# EAGLE design usb_to_can (EAGLE 9.4.2)
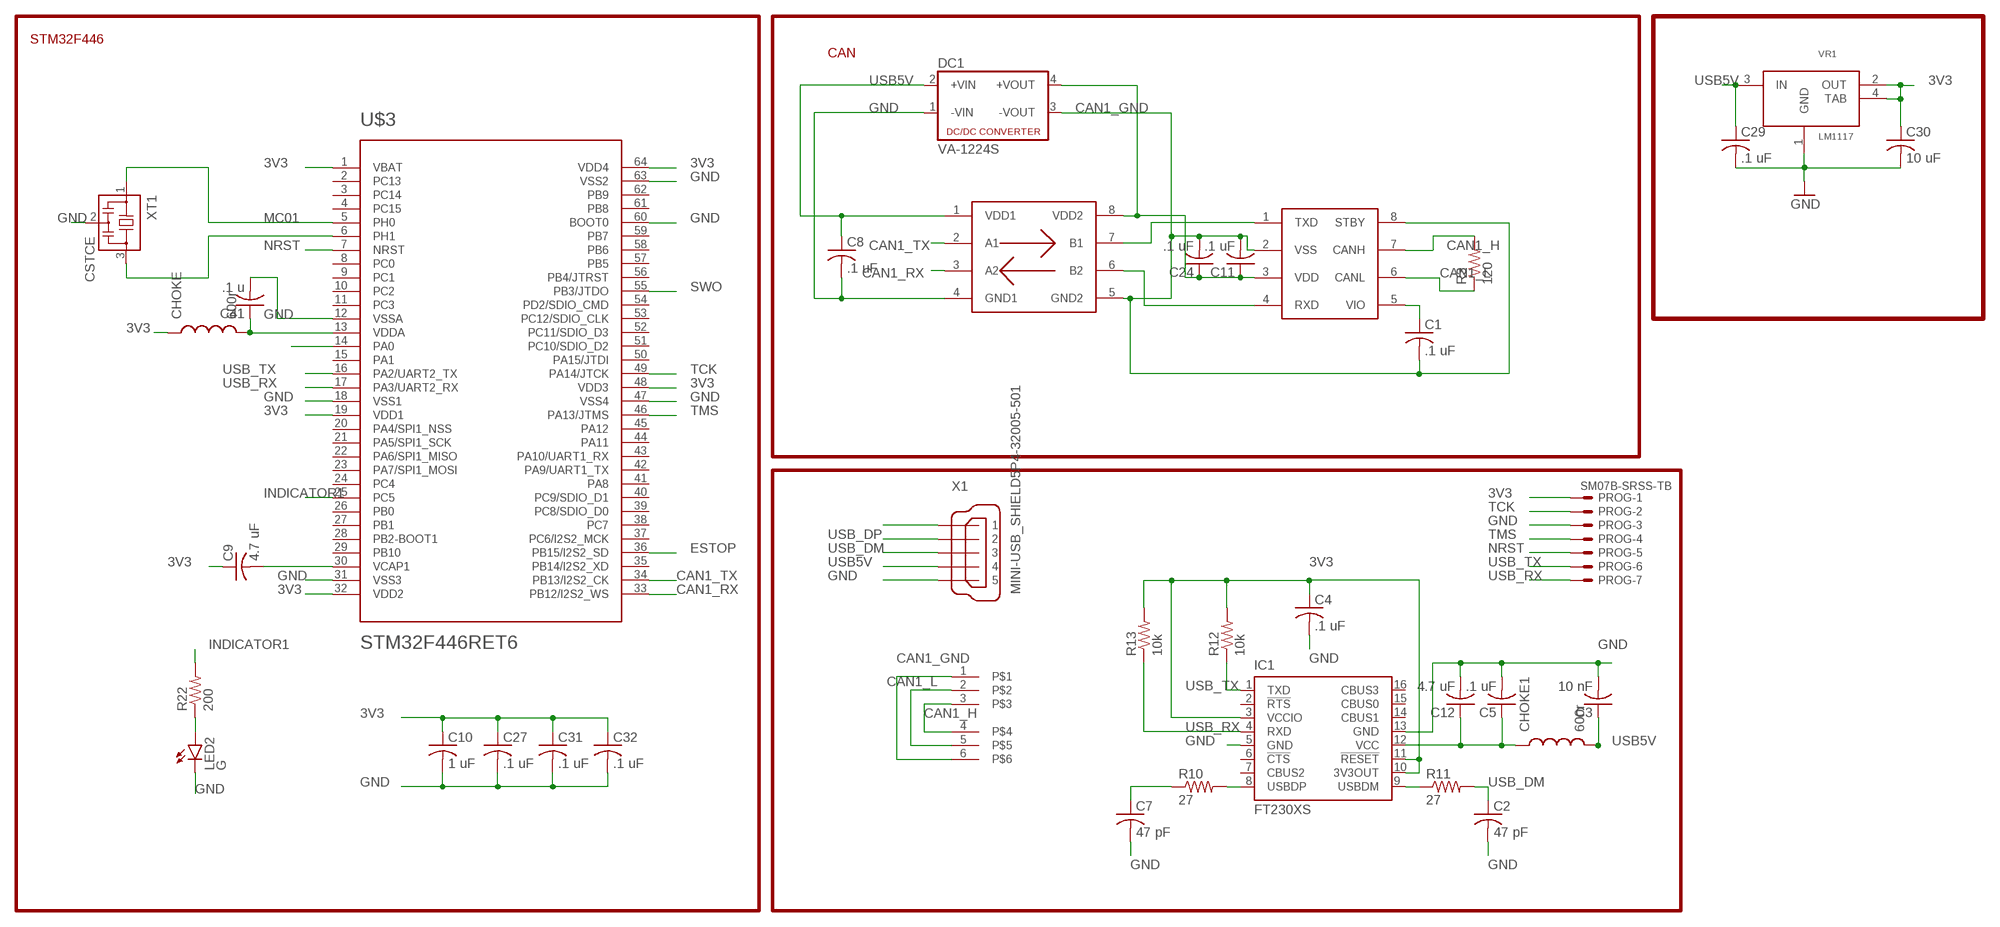
[diagram p0: schematic, sheet 1]

## Parts
C1  .1 uF  C-USC0402K  [C0402K]
C2  47 pF  C-USC0402K  [C0402K]
C3  10 nF  C-USC0402K  [C0402K]
C4  .1 uF  C-USC0402K  [C0402K]
C5  .1 uF  C-USC0402K  [C0402K]
C7  47 pF  C-USC0402K  [C0402K]
C8  .1 uF  C-USC0402K  [C0402K]
C9  4.7 uF  C-USC0402K  [C0402K]
C10  1 uF  C-USC0402K  [C0402K]
C11  .1 uF  C-USC0402K  [C0402K]
C12  4.7 uF  C-USC0402K  [C0402K]
C24  .1 uF  C-USC0402K  [C0402K]
C27  .1 uF  C-USC0402K  [C0402K]
C29  .1 uF  C-USC0402K  [C0402K]
C30  10 uF  C-USC0402K  [C0402K]
C31  .1 uF  C-USC0402K  [C0402K]
C32  .1 uF  C-USC0402K  [C0402K]
C41  .1 u  C-USC0402K  [C0402K]
CHOKE  600r  INDUCTOR0603  [0603]
CHOKE1  600r  INDUCTOR0603  [0603]
DC1  VA-1224S  [4SIL]
IC1  FT230XS  [SSOP16]
LED2  G  LED0603  [LED-0603]
PROG  SM07B-SRSS-TB  [SM07B-SRSS-TB]
R3  120  R-US_R0402  [R0402]
R10  27  R-US_R0402  [R0402]
R11  27  R-US_R0402  [R0402]
R12  10k  R-US_R0402  [R0402]
R13  10k  R-US_R0402  [R0402]
R22  200  R-US_R0402  [R0402]
U$1  6-PIN  [M80-5400642]
U$3  STM32F446RET6  [TQFP64]
U$4  MCP2561  [SO08]
U$8  SI8410  [SO08]
VR1  LM1117  [SOT-223]
X1  MINI-USB_SHIELD5P4-32005-501  [32005-501]
XT1  CSTCE  [CSTCE]

## Nets
3V3: C4.1 C9.1 C10.1 C27.1 C30.1 C31.1 C32.1 CHOKE.1 IC1.3(VCCIO) IC1.10(3V3OUT) IC1.11(!RESET) PROG.1 R12.2 R13.2 U$3.1(VBAT) U$3.19(VDD1) U$3.32(VDD2) U$3.48(VDD3) U$3.64(VDD4) VR1.2(OUT) VR1.4(TAB)
CAN1_GND: C1.2 C11.2 C24.2 DC1.3(-VOUT) U$1.1 U$1.6 U$4.2(VSS) U$4.8(STBY) U$8.5(GND2)
CAN1_H: R3.2 U$1.3 U$1.4 U$4.7(CANH)
CAN1_L: R3.1 U$1.2 U$1.5 U$4.6(CANL)
CAN1_RX: U$3.33(PB12/I2S2_WS) U$8.3(A2)
CAN1_TX: U$3.34(PB13/I2S2_CK) U$8.2(A1)
ESTOP: U$3.36(PB15/I2S2_SD)
GND: C2.2 C3.2 C4.2 C5.2 C7.2 C8.2 C10.2 C12.2 C27.2 C29.2 C30.2 C31.2 C32.2 C41.2 DC1.1(-VIN) IC1.5(GND) IC1.13(GND) LED2.C PROG.3 U$3.12(VSSA) U$3.18(VSS1) U$3.31(VSS3) U$3.47(VSS4) U$3.60(BOOT0) U$3.63(VSS2) U$8.4(GND1) VR1.1(GND) X1.5 XT1.2
INDICATOR1: R22.2 U$3.25(PC5)
MC01: U$3.5(PH0) XT1.1
N$2: C41.1 CHOKE.2 U$3.13(VDDA)
N$3: C9.2 U$3.30(VCAP1)
N$6: C1.1 U$4.5(VIO)
N$9: X1.1
N$10: C5.1 C12.1 CHOKE1.1 IC1.12(VCC)
N$11: IC1.8(USBDP) R10.2
N$12: C11.1 C24.1 DC1.4(+VOUT) U$4.3(VDD) U$8.8(VDD2)
N$14: U$4.1(TXD) U$8.7(B1)
N$15: IC1.9(USBDM) R11.1
N$16: U$4.4(RXD) U$8.6(B2)
N$24: U$3.14(PA0)
N$28: LED2.A R22.1
N$30: U$3.6(PH1) XT1.3
NRST: PROG.5 U$3.7(NRST)
SWO: U$3.55(PB3/JTDO)
TCK: PROG.2 U$3.49(PA14/JTCK)
TMS: PROG.4 U$3.46(PA13/JTMS)
USB5V: C3.1 C8.1 C29.1 CHOKE1.2 DC1.2(+VIN) U$8.1(VDD1) VR1.3(IN) X1.4
USB_DM: C2.1 R11.2 X1.3
USB_DP: C7.1 R10.1 X1.2
USB_RX: IC1.4(RXD) PROG.7 R13.1 U$3.17(PA3/UART2_RX)
USB_TX: IC1.1(TXD) PROG.6 R12.1 U$3.16(PA2/UART2_TX)
Unconnected: IC1.2(!RTS) IC1.6(!CTS) IC1.7(CBUS2) IC1.14(CBUS1) IC1.15(CBUS0) IC1.16(CBUS3) U$3.2(PC13) U$3.3(PC14) U$3.4(PC15) U$3.8(PC0) U$3.9(PC1) U$3.10(PC2) U$3.11(PC3) U$3.15(PA1) U$3.20(PA4/SPI1_NSS) U$3.21(PA5/SPI1_SCK) U$3.22(PA6/SPI1_MISO) U$3.23(PA7/SPI1_MOSI) U$3.24(PC4) U$3.26(PB0) U$3.27(PB1) U$3.28(PB2-BOOT1) U$3.29(PB10) U$3.35(PB14/I2S2_XD) U$3.37(PC6/I2S2_MCK) U$3.38(PC7) U$3.39(PC8/SDIO_D0) U$3.40(PC9/SDIO_D1) U$3.41(PA8) U$3.42(PA9/UART1_TX) U$3.43(PA10/UART1_RX) U$3.44(PA11) U$3.45(PA12) U$3.50(PA15/JTDI) U$3.51(PC10/SDIO_D2) U$3.52(PC11/SDIO_D3) U$3.53(PC12/SDIO_CLK) U$3.54(PD2/SDIO_CMD) U$3.56(PB4/JTRST) U$3.57(PB5) U$3.58(PB6) U$3.59(PB7) U$3.61(PB8) U$3.62(PB9) X1.M1(S1) X1.M2(S2) X1.M3(S3) X1.M4(S4)

## Notes on the sheet
- STM32F446
- CAN

## Library data of the parts
C1-C5 C7-C12 C24 C27 C29-C32 C41 = rcl:C-US: CAPACITOR, American symbol
CHOKE CHOKE1 = SparkFun-Passives:INDUCTOR: Inductors Basic Inductor/Choke - 0603 and 1206. Footprints are not proven and vary greatly between part numbers. INDUCTOR POWER 3.3UH 4.0A SMD 0.197" L x 0.197" W x 0.177" H (5.00mm x 5.00mm x 4.50mm)
DC1 = dc-dc-converter:VA-*?: DC DC Converter Single Output, 1 Watt Motien Technology Co.,Ltd. Source: va-serie.pdf; OC_FARNELL: unknown; OC_NEWARK: unknown
IC1 = ftdichip:FT230X: USB to BASIC UART IC Auto generated by make-symbol-device-package-bsdl.ulp Rev. 43 Source: Data sheet <http://www.ftdichip.com/Support/Documents/DataSheets/ICs/DS_FT230X.pdf>
LED2 = SparkFun-LED:LED: LEDs Standard schematic elements and footprints for 5mm, 3mm, 1206, and 0603 sized LEDs. 5mm - Spark Fun Electronics SKU : COM-00529 (and others)
PROG = con-jst2:?M07B-SRSS-TB: Disconnectable Crimp style connector, 1.0mm pitch 7 contacts
R3 R10-R13 R22 = rcl:R-US_: RESISTOR, American symbol
U$1 = Ben_Library:6-PIN
U$3 = BenLibrary:STM32F446RET6: ARM DSP Chip used on the WAV Trigger board.
U$4 = BenLibrary:MCP2561
U$8 = BenLibrary:SI8410
VR1 = sc_usercreated:LM1117
X1 = con-cypressindustries:MINI-USB_SHIELD5P4-: MINI USB-B R/A W/O POST 5 pol. Source: www.cypressindustries.com; OC_FARNELL: unknown; OC_NEWARK: unknown
XT1 = sc_usercreated:CSTCE

## Board
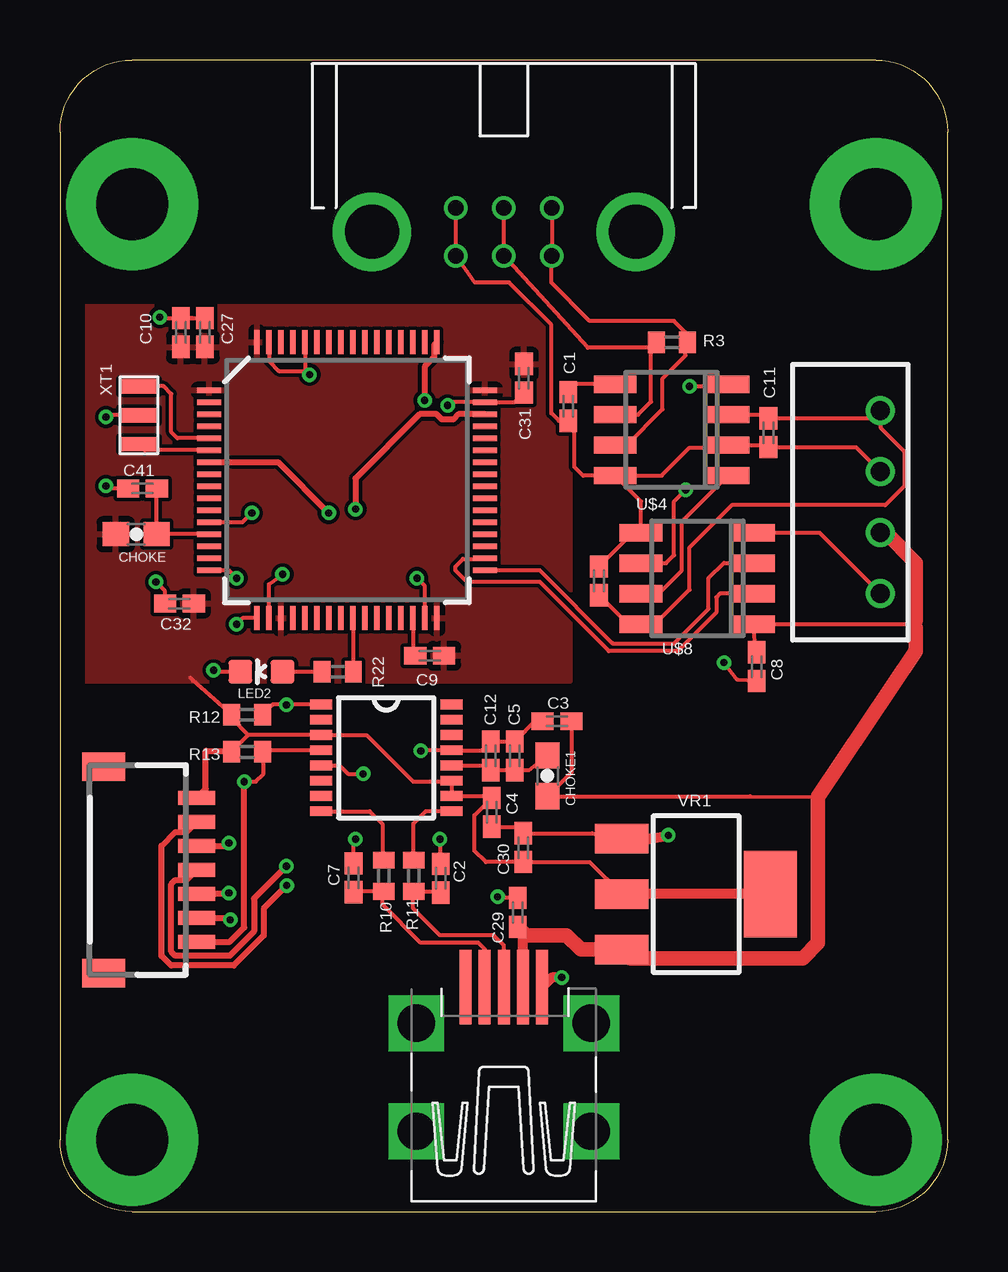
[diagram p1: board, top side]
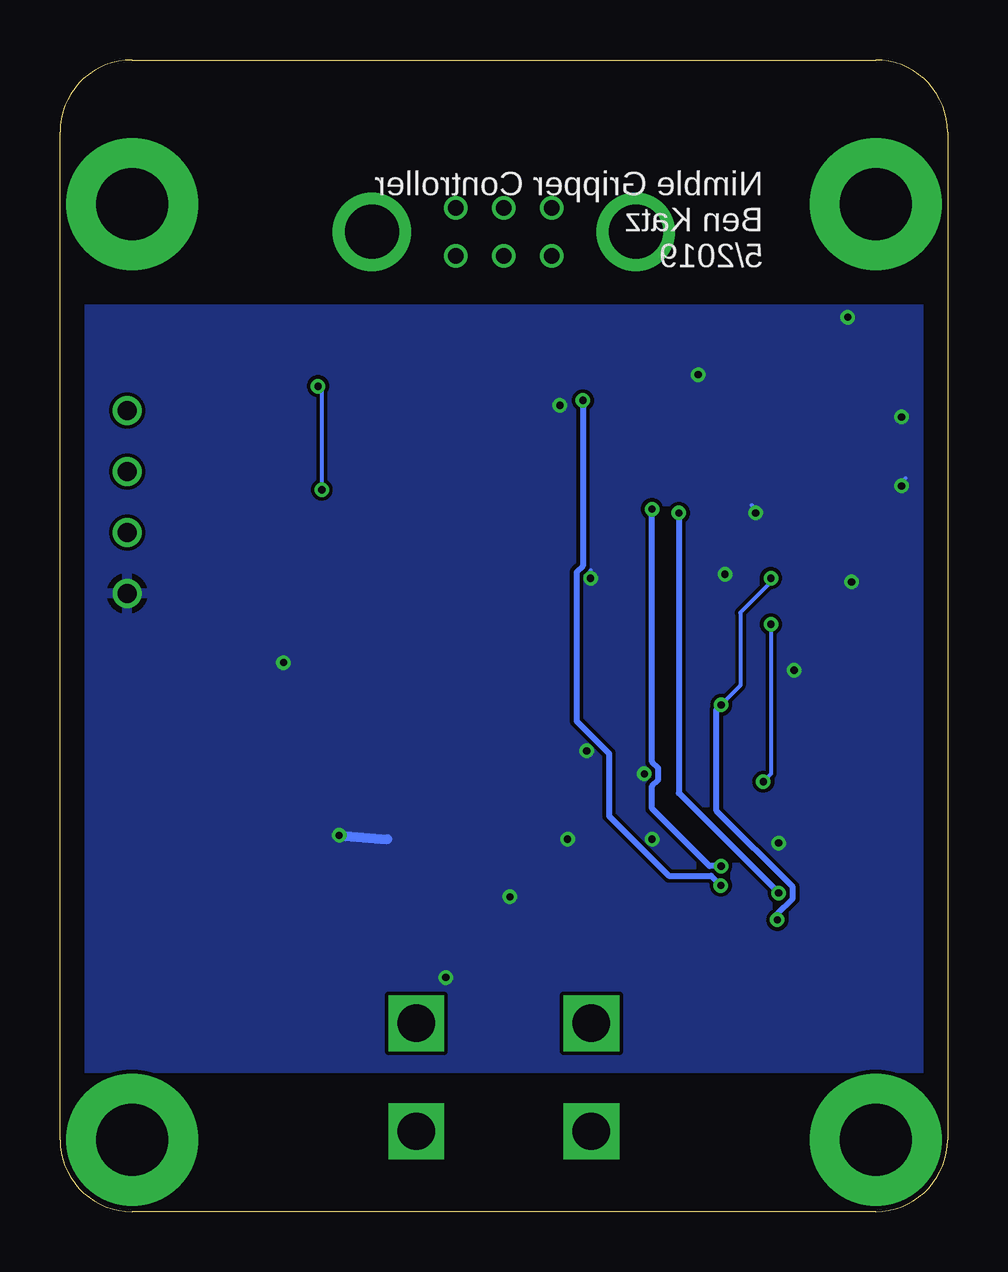
[diagram p2: board, bottom side, seen from below]

Size 37 x 48 mm. Coordinates in mm from the lower left corner, seen from the top.
Outline: 3,0 34,0 arc90 37,3 37,45 arc90 34,48 3,48 arc90 0,45 0,3 arc90 3,0
Copper layers (1*16): Top 0.035mm / dielectric 1.5mm / Bottom 0.035mm
Design rules "default *": minimum track width 6mil, minimum drill 0.3mm, track to track 6mil, track to pad 6mil, pad to pad 6mil, via to via 6mil, smd to smd 6mil, copper to edge 40mil, drill to drill 6mil, minimum pad ring 6mil, minimum via ring 6mil, stop-mask expansion 4mil, vias tented up to drill 0mil, thermal gap 10mil

### Footprints (pad centres in the part's own frame; a part is rotated, then mirrored left to right if it is on the bottom)
C0402K = smd 0.925 x 0.74: 1 -0.6,0; 2 0.6,0
0603 = smd 1.1 x 1: 1 -0.85,0; 2 0.85,0
4SIL = drill 0.8: 1 -3.81,0; 2 -1.27,0; 3 1.27,0; 4 3.81,0
SSOP16 = smd 0.914 x 0.406: 1 -2.718,2.223; 2 -2.718,1.587; 3 -2.718,0.953; 4 -2.718,0.318; 5 -2.718,-0.318; 6 -2.718,-0.953; 7 -2.718,-1.587; 8 -2.718,-2.223; 9 2.718,-2.223; 10 2.718,-1.587; 11 2.718,-0.953; 12 2.718,-0.318; 13 2.718,0.318; 14 2.718,0.953; 15 2.718,1.587; 16 2.718,2.223
LED-0603 = smd 1 x 1: A 0,-0.877; C 0,0.877
SM07B-SRSS-TB = smd 0.6 x 1.55: 1 -3,2.975; 2 -2,2.975; 3 -1,2.975; 4 0,2.975; 5 1,2.975; 6 2,2.975; 7 3,2.975 | smd 1.2 x 1.8: FIT@1 -4.3,-0.9; FIT@2 4.3,-0.9
R0402 = smd 0.7 x 0.9: 1 -0.65,0; 2 0.65,0
M80-5400642 = drill 0.65: 1 -2,0; 2 0,0; 3 2,0; 4 2,2; 5 0,2; 6 -2,2 | drill 2.25: P$1 5.5,1; P$2 -5.5,1
TQFP64 = smd 0.22 x 1: 1 -3.75,-5.75; 2 -3.25,-5.75; 3 -2.75,-5.75; 4 -2.25,-5.75; 5 -1.75,-5.75; 6 -1.25,-5.75; 7 -0.75,-5.75; 8 -0.25,-5.75; 9 0.25,-5.75; 10 0.75,-5.75; 11 1.25,-5.75; 12 1.75,-5.75; 13 2.25,-5.75; 14 2.75,-5.75; 15 3.25,-5.75; 16 3.75,-5.75; 33 3.75,5.75; 34 3.25,5.75; 35 2.75,5.75; 36 2.25,5.75; 37 1.75,5.75; 38 1.25,5.75; 39 0.75,5.75; 40 0.25,5.75; 41 -0.25,5.75; 42 -0.75,5.75; 43 -1.25,5.75; 44 -1.75,5.75; 45 -2.25,5.75; 46 -2.75,5.75; 47 -3.25,5.75; 48 -3.75,5.75 | smd 1 x 0.22: 17 5.75,-3.75; 18 5.75,-3.25; 19 5.75,-2.75; 20 5.75,-2.25; 21 5.75,-1.75; 22 5.75,-1.25; 23 5.75,-0.75; 24 5.75,-0.25; 25 5.75,0.25; 26 5.75,0.75; 27 5.75,1.25; 28 5.75,1.75; 29 5.75,2.25; 30 5.75,2.75; 31 5.75,3.25; 32 5.75,3.75; 49 -5.75,3.75; 50 -5.75,3.25; 51 -5.75,2.75; 52 -5.75,2.25; 53 -5.75,1.75; 54 -5.75,1.25; 55 -5.75,0.75; 56 -5.75,0.25; 57 -5.75,-0.25; 58 -5.75,-0.75; 59 -5.75,-1.25; 60 -5.75,-1.75; 61 -5.75,-2.25; 62 -5.75,-2.75; 63 -5.75,-3.25; 64 -5.75,-3.75
SO08 = smd 0.72 x 1.78: 1 -1.905,-2.35; 2 -0.635,-2.35; 3 0.635,-2.35; 4 1.905,-2.35; 5 1.905,2.35; 6 0.635,2.35; 7 -0.635,2.35; 8 -1.905,2.35
SOT-223 = smd 1.219 x 2.235: 1 -2.311,-3.099; 2 0,-3.099; 3 2.311,-3.099 | smd 3.6 x 2.2: 4 0,3.099
32005-501 = smd 3.1 x 0.5: 1 3,1.6; 2 3,0.8; 3 3,0; 4 3,-0.8; 5 3,-1.6 | drill 1.55 square: M1 -3,3.65; M2 -3,-3.65; M3 1.5,3.65; M4 1.5,-3.65
CSTCE = smd 0.6 x 1.6: 1 -1.2,0; 2 0,0; 3 1.2,0

### Placement (x,y rotation side)
C1  .1uF  [C0402K]  21.19,33.56 270 top
C2  15.87,13.89 90 top
C3  20.72,20.44 180 top
C4  18,16.64 270 top
C5  18.96,19 90 top
C7  12.24,13.91 90 top
C8  .1uF  [C0402K]  29.04,22.71 270 top
C9  4.7  [C0402K]  15.41,23.17 180 top
C10  1uF  [C0402K]  5.04,36.64 90 top
C11  .1uF  [C0402K]  29.53,32.46 270 top
C12  17.96,19 90 top
C24  .1uF  [C0402K]  22.47,26.29 90 top
C27  100nF  [C0402K]  6.04,36.64 90 top
C29  100nF  [C0402K]  19.08,12.47 90 top
C30  10uF  [C0402K]  19.31,15.17 90 top
C31  100nF  [C0402K]  19.34,34.73 270 top
C32  100nF  [C0402K]  4.98,25.34 180 top
C41  15 nF  [C0402K]  3.44,30.14 180 top
CHOKE  3.18,28.23 0 top
CHOKE1  20.32,18.16 270 top
DC1  34.2,29.57 90 top
IC1  13.6,18.91 0 top
LED2  8.4,22.5 90 top
PROG  2.72,14.24 270 top
R3  25.51,36.23 0 top
R10  13.5,14 90 top
R11  14.75,14 270 top
R12  7.8,20.71 180 top
R13  7.8,19.16 180 top
R22  70  [R0402]  11.58,22.5 0 top
U$1  18.5,39.84 0 top
U$3  11.96,30.48 270 top
U$4  25.49,32.58 90 top
U$8  26.57,26.39 90 top
VR1  26.52,13.23 270 top
X1  18.5,6.35 90 top
XT1  3.29,33.19 270 top

### Tracks (layer width: path | path; a pad name or v marks a point on that pad's centre or on a via)
3V3
  Top 0.16: C30.1 19.31,14.29 | C30.1 17.75,14.57 17.28,15.04 17.28,16.52 C4.1 17.92,17.32 IC1.10 IC1.11 16.28,17.92 14.72,17.92 12.78,19.86 IC1.3 7.85,19.86 | 7.85,19.86 R13.2 | 7.85,19.86 7.15,20.57 R12.2 5.55,22.13 5.44,22.24 | C30.1 22.08,14.57 VR1.2
  Top 0.254: PROG.1 6.08,17.62 6.08,19.2 7.11,19.2 R13.2
  Top 0.406: VR1.4 VR1.2
  pour Top: 0.96,37.76 21.28,37.76 21.28,22.08 0.96,22.08
CAN1_GND
  Top 0.16: DC1.3 33.18,31.86 C11.2 29.45,31.95 U$4.2 27.73,31.84 26.24,31.84 25.07,30.68 U$4.8 | C24.2 23.88,28.3 U$8.5 24.22,29.59 U$4.8 | U$4.8 21.8,30.68 21.44,31.04 21.44,32.55 C1.2 20.8,32.96 20.48,33.28 20.48,36.96 18.72,38.72 17.3,38.72 U$1.1 U$1.6
CAN1_H
  Top 0.16: U$4.7 23.62,31.95 25.12,33.44 25.12,34.72 26.08,35.68 26.08,36.15 | 26.08,36.15 R3.2 | U$1.4 U$1.3 20.48,39.5 20.48,38.72 22.08,37.12 25.6,37.12 26.08,36.64 26.08,36.15
CAN1_L
  Top 0.16: U$4.6 24.09,33.22 24.64,33.76 24.64,36.01 | 24.64,36.01 R3.1 | 24.64,36.01 22.01,36.01 U$1.2 U$1.5
CAN1_RX
  Top 0.16: U$3.33 19.99,26.73 23.04,23.68 25.6,23.68 27.04,25.12 27.04,26.4 27.68,27.04 28.91,27.04 U$8.3
CAN1_TX
  Top 0.16: U$8.2 27.52,25.75 27.36,25.6 27.36,24.96 25.76,23.36 22.88,23.36 20,26.24 16.96,26.24 16.48,26.72 16.48,26.88 16.8,27.2 17.68,27.2 U$3.34
GND  (via drill 0.3)
  Top 0.16: C2.2 15.87,15.49 v15.84,15.52 | C7.2 12.24,15.44 v12.32,15.52 | v15.04,19.2 15.07,19.23 IC1.13 17.59,19.23 C12.2 C5.2 19.8,20.44 C3.2 | C29.2 18.29,13.07 v18.24,13.12 | C4.2 19.04,16.04 C30.2 22.19,15.77 VR1.1 | IC1.5 11.65,18.59 12,18.24 v12.64,18.24 | U$3.60 10.21,35.07 v10.4,34.88 10.24,35.04 9.12,35.04 8.71,35.45 U$3.63 | C10.2 C27.2 | v4.16,37.28 4.12,37.24 C10.2 | XT1.2 1.99,33.19 v1.92,33.12 | U$3.12 7.61,28.73 v8,29.12 | C41.2 2.02,30.14 v1.92,30.24 | C32.2 4.38,25.86 v4,26.24 | U$3.18 8.71,26.15 v9.28,26.56 | U$3.31 15.21,26.07 v14.88,26.4 | C31.2 18.94,33.73 U$3.47 16.29,33.73 v16.16,33.6 | LED2.C 6.46,22.5 v6.4,22.56 | U$8.4 31.66,28.3 DC1.1 | C8.2 28.24,22.16 v27.68,22.88 | 5.52,37.24 C10.2
  Top 0.254: PROG.3 6.92,15.24 v7.04,15.36
  Top 0.406: VR1.1 24.58,15.54 v25.36,15.68 | v20.92,9.76 20.51,9.76 X1.5
  Bottom 0.16: v15.84,15.52 15.84,15.68 | v12.32,15.52 12.48,15.68 | v15.04,19.2 14.88,19.04 | v18.24,13.12 18.08,13.28 | v10.4,34.88 10.56,34.72 | v1.92,33.12 2.08,32.96 | v8,29.12 8,29.28 8.16,29.44 | v1.92,30.24 1.92,30.4 1.76,30.56 | v4,26.24 3.84,26.08 | v9.28,26.56 9.44,26.72 | v14.88,26.4 14.88,26.72 | v16.16,33.6 16,33.44 | v6.4,22.56 6.24,22.72
  Bottom 0.406: v25.36,15.68 23.36,15.52
  pour Bottom: 0,37.6 37,37.6 37,6 0,6
INDICATOR1
  Top 0.16: U$3.25 12.21,22.6 R22.2
MC01
  Top 0.16: U$3.5 4.89,32.23 4.64,32.48 4.64,34.08 4.32,34.4 XT1.1
N$1  (via drill 3 pad 5.5)
  other vias: 3,3
N$2
  Top 0.16: U$3.13 CHOKE.2 C41.1
N$3
  Top 0.16: U$3.30 14.71,23.27 C9.2
N$4  (via drill 3 pad 5.5)
  other vias: 34,3
N$5  (via drill 3 pad 5.5)
  other vias: 34,42
N$6
  Top 0.16: U$4.5 21.52,34.48 C1.1
N$7  (via drill 3 pad 5.5)
  other vias: 3,42
N$10
  Top 0.16: IC1.12 17.77,18.59 C12.1 C5.1 19.55,18.4 CHOKE1.1
N$11
  Top 0.16: IC1.8 12.91,16.69 13.44,16.16 13.44,14.71 R10.2
N$12
  Top 0.16: U$4.3 29.38,33.22 C11.1 33.88,33.06 | C24.1 23.68,24.48 U$8.8 24.8,24.48 26.24,25.92 26.24,27.68 28,29.44 34.4,29.44 35.2,30.24 35.2,31.68 34.2,32.68 DC1.4
  Top 0.254: DC1.4 33.88,33.06
N$14
  Top 0.16: U$8.7 24.96,25.76 25.92,26.72 25.92,28.75 U$4.1
N$15
  Top 0.16: IC1.9 15.25,16.69 14.72,16.16 14.72,14.68 R11.1
N$16  (via drill 0.3)
  Top 0.16: v26.24,34.4 27.75,34.4 U$4.4 | U$8.6 25.27,27.02 25.6,27.36 25.6,29.6 v26.08,30.08
  Bottom 0.16: v26.08,30.08 26.08,34.24 v26.24,34.4
N$28
  Top 0.16: R22.1 LED2.A
N$30
  Top 0.16: U$3.6 3.55,31.73 XT1.3
NRST  (via drill 0.3)
  Top 0.254: U$3.7 9.09,31.23 v11.2,29.12 | v7.04,13.28 7,13.24 PROG.5
  Bottom 0.254: v11.2,29.12 11.2,17.44 v7.04,13.28
TCK  (via drill 0.3)
  Top 0.254: U$3.49 15.6,36.12 15.6,35.61 15.2,35.22 v15.2,33.81 | PROG.2 5.27,15.82 4.8,15.82 4.23,15.25 4.23,10.66 4.64,10.25 7.24,10.25 8.49,11.5 8.49,12.63 v9.45,13.59
  Bottom 0.254: v15.2,33.81 15.2,26.91 15.46,26.65 15.46,20.45 14.11,19.09 14.11,16.48 11.62,13.99 9.86,13.99 v9.45,13.59
TMS  (via drill 0.3)
  Top 0.254: U$3.46 16.61,33.23 16.4,33.02 15.92,33.02 15.71,33.23 14.99,33.23 12.32,30.56 v12.32,29.28 | PROG.4 5.27,13.82 4.8,13.82 4.64,13.66 4.64,10.82 4.8,10.66 7.08,10.66 8.09,11.67 8.09,13.05 v9.44,14.4
  Bottom 0.254: v9.44,14.4 9.92,14.4 12.32,16.8 12.32,17.74 12.06,18 12.06,18.48 12.32,18.74 v12.32,29.28
USB5V
  Top 0.16: C3.1 21.32,18.31 CHOKE1.2 28.77,17.31 31.6,17.28 | 35.68,24.64 35.52,24.48 U$8.1 29,23.28 C8.1
  Top 0.406: X1.4 19.3,11.65 C29.1
  Top 0.61: DC1.2 34.42,28.3 35.68,27.04 35.68,24.64 | 35.52,24.48 35.68,24.33 35.68,23.36 31.6,17.28 31.6,11.2 30.96,10.56 23.78,10.56 VR1.3 21.72,10.92 21.12,11.52 19.43,11.52 C29.1
USB_DM
  Top 0.16: C2.1 15.81,13.35 R11.2 14.72,13.32 14.72,12.64 15.84,11.52 18.08,11.52 18.5,11.1 X1.3
USB_DP
  Top 0.16: C7.1 12.28,13.35 R10.1 13.44,13.29 13.44,12.8 15.04,11.2 17.44,11.2 17.7,10.94 X1.2
USB_RX  (via drill 0.3)
  Top 0.16: IC1.4 8.52,19.23 R13.1 8.48,19.13 8.48,18.24 8.16,17.92 v7.68,17.92 | U$3.17 7.61,24.73 v7.36,24.48
  Top 0.254: PROG.7 7.08,11.24 7.68,11.84 v7.68,17.92
  Bottom 0.16: v7.36,24.48 7.36,18.24 v7.68,17.92
USB_TX  (via drill 0.3)
  Top 0.16: IC1.1 9.44,21.13 | 9.44,21.13 8.87,21.13 R12.1 | U$3.16 7.03,26.73 v7.36,26.4 | v9.44,21.12 9.44,21.13
  Top 0.254: PROG.6 7.02,12.24 v7.1,12.16
  Bottom 0.16: v7.36,26.4 7.36,26.24 8.64,24.96 8.64,21.92 v9.44,21.12
  Bottom 0.254: v7.1,12.16 7.1,12.4 6.46,13.04 6.46,13.52 9.63,16.7 9.63,20.93 v9.44,21.12

### Text on the board
bNames: Nimble Gripper Controller / Ben Katz / 5/2019